# EAGLE design ISP (EAGLE 9.5.1)
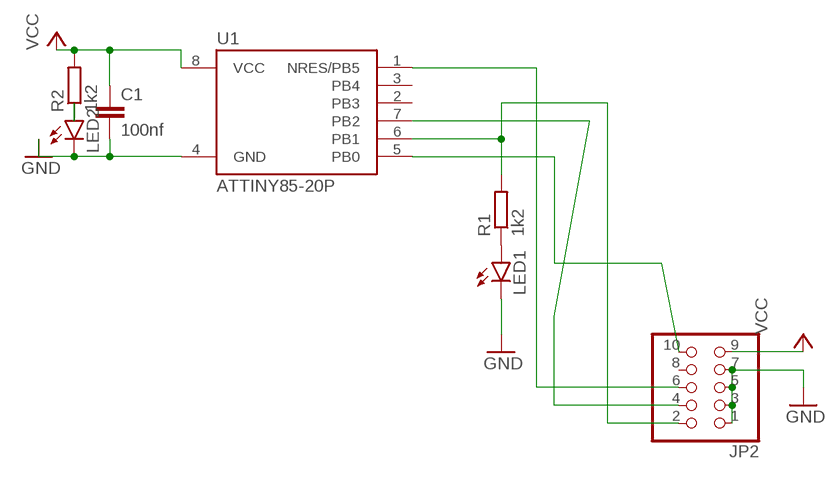
[diagram p0: schematic, sheet 1]

## Parts
C1  100nf  C5/2.5  [C5B2.5]
JP2  PINHD-2X5  [2X05]
LED1  LED5MM  [LED5MM]
LED2  LED5MM  [LED5MM]
R1  1k2  R-EU_0204/7  [0204/7]
R2  1k2  R-EU_0204/7  [0204/7]
U1  ATTINY85-20P  [PDIP08_300MIL]

## Nets
GND: C1.2 JP2.1 JP2.3 JP2.5 JP2.7 LED1.K(C) LED2.K(C) U1.4(GND)
N$1: JP2.6 U1.1(NRES/PB5)
N$2: JP2.4 U1.7(PB2)
N$3: JP2.2 R1.2 U1.6(PB1)
N$4: JP2.10 U1.5(PB0)
N$5: LED1.A R1.1
N$6: LED2.A R2.1
VCC: C1.1 JP2.9 R2.2 U1.8(VCC)
Unconnected: JP2.8 U1.2(PB3) U1.3(PB4)

## Library data of the parts
C1 = capacitor-wima:C: CAPACITOR naming: grid - package width
JP2 = pinhead:PINHD-2X5: PIN HEADER
LED1 LED2 = led:LED: LED OSRAM: - CHIPLED LG R971, LG N971, LY N971, LG Q971, LY Q971, LO R971, LY R971 LH N974, LH R974 LS Q976, LO Q976, LY Q976 LO Q996 - Hyper CHIPLED LW Q18S LB Q993, LB Q99A, LB R99A - SideLED LS A670, LO A670, LY A670, LG A670, LP A670 LB A673, LV A673, LT A673, LW A673 LH A674 LY A675 LS A676, LA A676, LO A676, LY A676, LW A676 LS A679, LY A679, LG A679 - Hyper Micro SIDELED® LS Y876, LA Y876, LO Y876, LY Y876 LT Y87S - SmartLED LW L88C, LW L88S LB L89C, LB L89S, LG L890 LS L89K, LO L89K, LY L89K LS L896, LA L896, LO L896, LY L896 - TOPLED LS T670, LO T670, LY T670, LG T670, LP T670 LSG T670, LSP T670, LSY T670, LOP T670, LYG T670 LG T671, LOG T671, LSG T671 LB T673, LV T673, LT T673, LW T673 LH T674 LS T676, LA T676, LO T676, LY T676, LB T676, LH T676, LSB T676, LW T676 LB T67C, LV T67C, LT T67C, LS T67K, LO T67K, LY T67K, LW E67C LS E67B, LA E67B, LO E67B, LY E67B, LB E67C, LV E67C, LT E67C LW T67C LS T679, LY T679, LG T679 LS T770, LO T770, LY T770, LG T770, LP T770 LB T773, LV T773, LT T773, LW T773 LH T774 LS E675, LA E675, LY E675, LS T675 LS T776, LA T776, LO T776, LY T776, LB T776 LHGB T686 LT T68C, LB T68C - Hyper Mini TOPLED® LB M676 - Mini TOPLED Santana® LG M470 LS M47K, LO M47K, LY M47K Source: http://www.osram.convergy.de LUXEON: - LUMILED® LXK2-PW12-R00, LXK2-PW12-S00, LXK2-PW14-U00, LXK2-PW14-V00 LXK2-PM12-R00, LXK2-PM12-S00, LXK2-PM14-U00 LXK2-PE12-Q00, LXK2-PE12-R00, LXK2-PE12-S00, LXK2-PE14-T00, LXK2-PE14-U00 LXK2-PB12-K00, LXK2-PB12-L00, LXK2-PB12-M00, LXK2-PB14-N00, LXK2-PB14-P00, LXK2-PB14-Q00 LXK2-PR12-L00, LXK2-PR12-M00, LXK2-PR14-Q00, LXK2-PR14-R00 LXK2-PD12-Q00, LXK2-PD12-R00, LXK2-PD12-S00 LXK2-PH12-R00, LXK2-PH12-S00 LXK2-PL12-P00, LXK2-PL12-Q00, LXK2-PL12-R00 Source: www.luxeon.com KINGBRIGHT: KA-3528ASYC Source: www.kingbright.com
R1 R2 = rcl:R-EU_: RESISTOR, European symbol; SPICEPREFIX: R
U1 = _hhn_attiny25_45_85:ATTINY85*: ATMEL ATtiny 85 Packages: P = PDIP 08 30mil S = SOIC 08 EIAJ 208mil Technologies Note: for complete ordering code (temp. range, finish, tape&reel etc.) see www.atmel.com • Supply Voltage: V = (1.8…5.5)V | [blank] = (2.7…5.5)V • Speed: 10 = 10 MHz | 20 = 20 MHz Author: Dipl.-Ing. FH Rainer Bayer HHN Hochschule Heilbronn (Heilbronn University), rainer.bayer@hs-heilbronn.de Ingenieurbüro ing-rb, mail@ing-rb.de

## Board
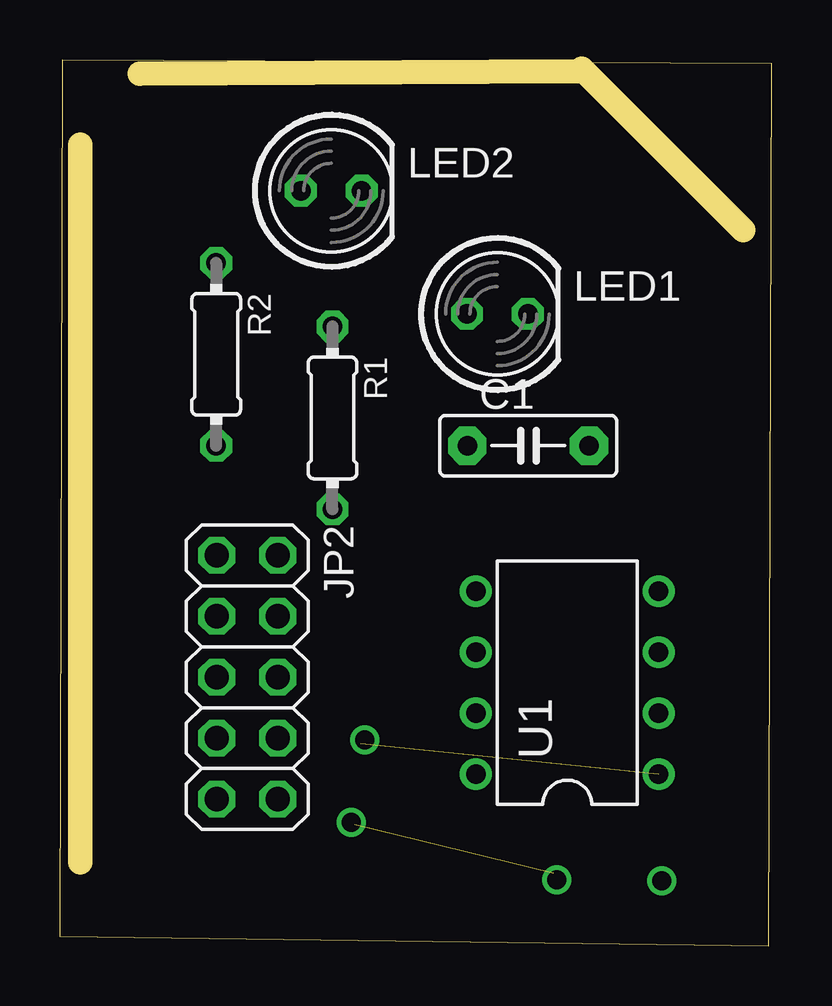
[diagram p1: board, top side]
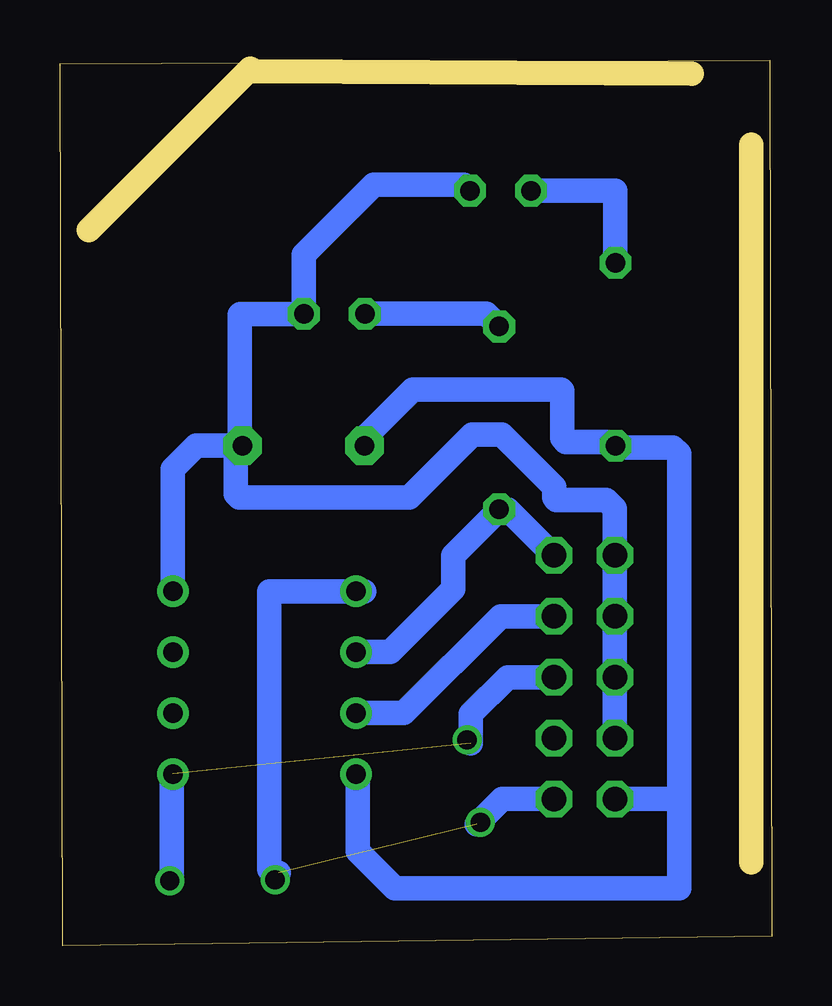
[diagram p2: board, bottom side, seen from below]

Size 29.65 x 36.92 mm. Coordinates in mm from the lower left corner, seen from the top.
Outline: 0,0.38 29.54,0 29.65,36.76 0.09,36.92 0,0.38
Copper layers (1*16): Top 0.035mm / dielectric 1.5mm / Bottom 0.035mm
Design rules "default *": minimum track width 6mil, minimum drill 0.35mm, track to track 25mil, track to pad 25mil, pad to pad 25mil, via to via 25mil, smd to smd 25mil, copper to edge 40mil, drill to drill 6mil, minimum pad ring 10mil, minimum via ring 8mil, stop-mask expansion 4mil, vias tented up to drill 0mil, thermal gap 10mil
Milling: 4 lines

### Footprints (pad centres in the part's own frame; a part is rotated, then mirrored left to right if it is on the bottom)
C5B2.5 = drill 0.813 pad 1.6 octagon: 1 -2.54,0; 2 2.54,0
2X05 = drill 1.016 octagon: 1 -5.08,-1.27; 2 -5.08,1.27; 3 -2.54,-1.27; 4 -2.54,1.27; 5 0,-1.27; 6 0,1.27; 7 2.54,-1.27; 8 2.54,1.27; 9 5.08,-1.27; 10 5.08,1.27
LED5MM = drill 0.813 octagon: A -1.27,0; K 1.27,0
0204/7 = drill 0.813 octagon: 1 -3.81,0; 2 3.81,0
PDIP08_300MIL = drill 0.813: 1 -3.81,-3.81; 2 -1.27,-3.81; 3 1.27,-3.81; 4 3.81,-3.81; 5 3.81,3.81; 6 1.27,3.81; 7 -1.27,3.81; 8 -3.81,3.81

### Placement (x,y rotation side)
C1  19.51,20.83 0 top
JP2  7.8,11.19 270 top
LED1  18.22,26.33 0 top
LED2  11.3,31.47 0 top
R1  11.35,22 270 top
R2  6.51,24.64 270 top
U1  21.14,10.96 90 top

### Tracks (layer width: path | path; a pad name or v marks a point on that pad's centre or on a via)
GND
  Bottom 0.152: 25.01,14.89 U1.4
  Bottom 0.508: 22.17,20.83 C1.2 | 22.13,26.33 22.17,26.29
  Bottom 1.016: LED2.K 12.82,31.72 16.57,31.72 19.49,28.8 LED1.K 22.13,26.33 | U1.4 24.95,19.86 23.97,20.83 22.17,20.83 | 22.17,26.29 22.17,20.83 | JP2.7 JP2.5 JP2.3 JP2.1 6.53,18.22 6.89,18.57 8.97,18.57 9.06,18.67 9.06,19.12 11.24,21.3 12.48,21.3 15.1,18.67 22.18,18.67 22.33,18.82 22.33,20.68 22.17,20.83
N$1  (1 unrouted)
  Bottom 1.016: U1.1 24.99,7.1 24.99,2.81 | JP2.6 11.01,11.19 12.53,9.66 12.53,8.42
N$2
  Bottom 1.016: JP2.4 11.29,13.73 15.33,9.69 U1.7
N$3
  Bottom 1.016: JP2.2 10.99,18.19 R1.2 13.27,16.27 13.27,14.86 15.9,12.23 U1.6
N$4  (1 unrouted)
  Bottom 1.016: JP2.10 11.24,6.11 12.28,5.06 | 16.98,14.77 U1.5 20.94,14.77 20.94,3.18 20.74,2.98 20.59,2.98 20.54,3.03
N$5
  Bottom 1.016: LED1.A 16.93,26.35 11.9,26.35 R1.1
N$6
  Bottom 1.016: R2.1 6.51,31.47 LED2.A
N$8  (via drill 0.8)
  other vias: 20.69,2.73
N$9  (via drill 0.8)
  other vias: 12.69,8.58
N$11  (via drill 0.8)
  other vias: 12.14,5.13
N$12  (via drill 0.8)
  other vias: 25.08,2.7
VCC
  Bottom 0.152: 6.51,20.94 R2.2 6.73,20.76 | 17.24,7.06 U1.8
  Bottom 0.508: 6.73,20.93 6.73,20.76 | C1.1 16.88,20.93
  Bottom 1.016: 3.86,6.05 3.86,16.44 3.86,20.5 4.12,20.76 6.43,20.76 R2.2 6.67,21 8.57,21 8.72,21.15 8.72,23.13 8.77,23.18 14.95,23.18 16.97,21.16 C1.1 | 3.86,6.05 3.86,2.38 15.7,2.38 17.24,3.92 17.24,7.06 | JP2.9 3.92,6.11 3.86,6.05